# Altium schematic sheet APD9328_FPGA.SchDoc: FPGA TOP
size A4; Author: NC; Revision: 1.0; SheetNumber: 12; SheetTotal: 14
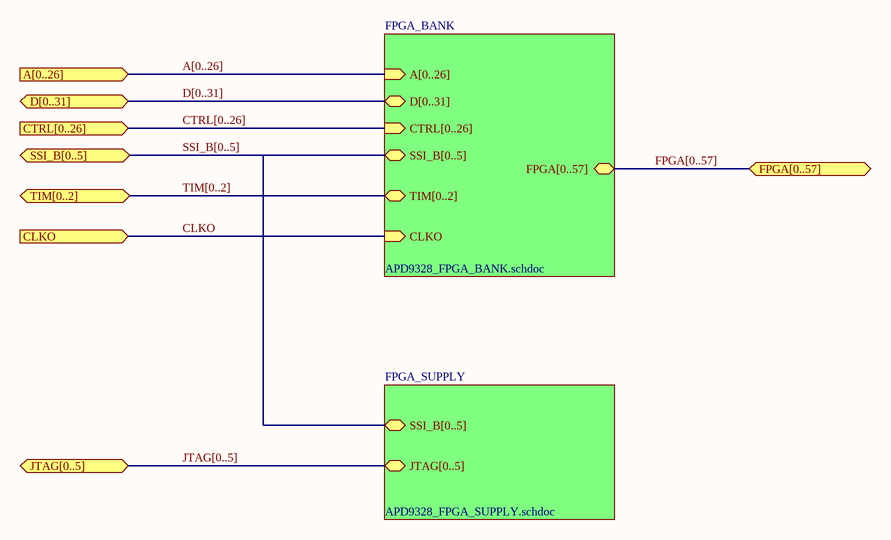
[diagram p0: APD9328_FPGA.SchDoc]

## Sub-sheets
FPGA_BANK = APD9328_FPGA_BANK.schdoc: A[0..26] (in), D[0..31] (bidir), CTRL[0..26] (in), CLKO (in), FPGA[0..57] (bidir), SSI_B[0..5] (bidir), TIM[0..2] (bidir)
FPGA_SUPPLY = APD9328_FPGA_SUPPLY.schdoc: SSI_B[0..5] (bidir), JTAG[0..5] (bidir)

## Ports
A[0..26] (in), CLKO (in), CTRL[0..26] (in), D[0..31] (bidir), FPGA[0..57] (bidir), JTAG[0..5] (bidir), SSI_B[0..5] (bidir), TIM[0..2] (bidir)

## Nets
CLKO: port CLKO, sheet FPGA_BANK/CLKO

## Buses and harness runs
bus A[0..26] = port A[0..26] = sheet FPGA_BANK/A[0..26]
bus CTRL[0..26] = port CTRL[0..26] = sheet FPGA_BANK/CTRL[0..26]
bus D[0..31] = port D[0..31] = sheet FPGA_BANK/D[0..31]
bus FPGA[0..57] = port FPGA[0..57] = sheet FPGA_BANK/FPGA[0..57]
bus JTAG[0..5] = port JTAG[0..5] = sheet FPGA_SUPPLY/JTAG[0..5]
bus SSI_B[0..5] = port SSI_B[0..5] = sheet FPGA_BANK/SSI_B[0..5] = sheet FPGA_SUPPLY/SSI_B[0..5]
bus TIM[0..2] = port TIM[0..2] = sheet FPGA_BANK/TIM[0..2]

## Notes on the sheet
- Title
- Size:
- Date:
- A4
- Author:
- Revision:
- Sheet
- of
- Armadeus Embedded Solutions
- File: